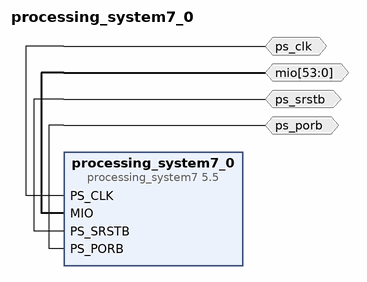
[diagram p0: block diagram of the top level]
# Vivado block design processing_system7_0, xc7z010clg400-1, Vivado 2026.1
create_bd_design processing_system7_0

create_bd_port -dir IO ps_clk
create_bd_port -dir IO ps_srstb
create_bd_port -dir IO -from 53 -to 0 mio
create_bd_port -dir IO ps_porb

create_bd_cell -type ip -vlnv xilinx.com:ip:processing_system7:5.5 processing_system7_0
set_property -dict [list \
  CONFIG.PCW_EN_CLK0_PORT 0 \
  CONFIG.PCW_EN_RST0_PORT 0 \
  CONFIG.PCW_SD0_GRP_CD_ENABLE 0 \
  CONFIG.PCW_SD0_GRP_WP_ENABLE 0 \
  CONFIG.PCW_SD0_PERIPHERAL_ENABLE 1 \
  CONFIG.PCW_SD0_SD0_IO {MIO 40 .. 45} \
  CONFIG.PCW_SDIO_PERIPHERAL_FREQMHZ 100 \
  CONFIG.PCW_UIPARAM_DDR_ENABLE 0 \
  CONFIG.PCW_USE_M_AXI_GP0 0 \
] [get_bd_cells processing_system7_0]
# 52 more settings of processing_system7_0 are not shown: defaults, MIO pin electricals, DDR timing, and values the tool derives

# ---- connections ----

connect_bd_net [get_bd_ports ps_clk] [get_bd_pins processing_system7_0/PS_CLK]
connect_bd_net [get_bd_ports ps_srstb] [get_bd_pins processing_system7_0/PS_SRSTB]
connect_bd_net [get_bd_ports mio] [get_bd_pins processing_system7_0/MIO]
connect_bd_net [get_bd_ports ps_porb] [get_bd_pins processing_system7_0/PS_PORB]

validate_bd_design
save_bd_design
